# EAGLE design usb lcd  (EAGLE 6.1)
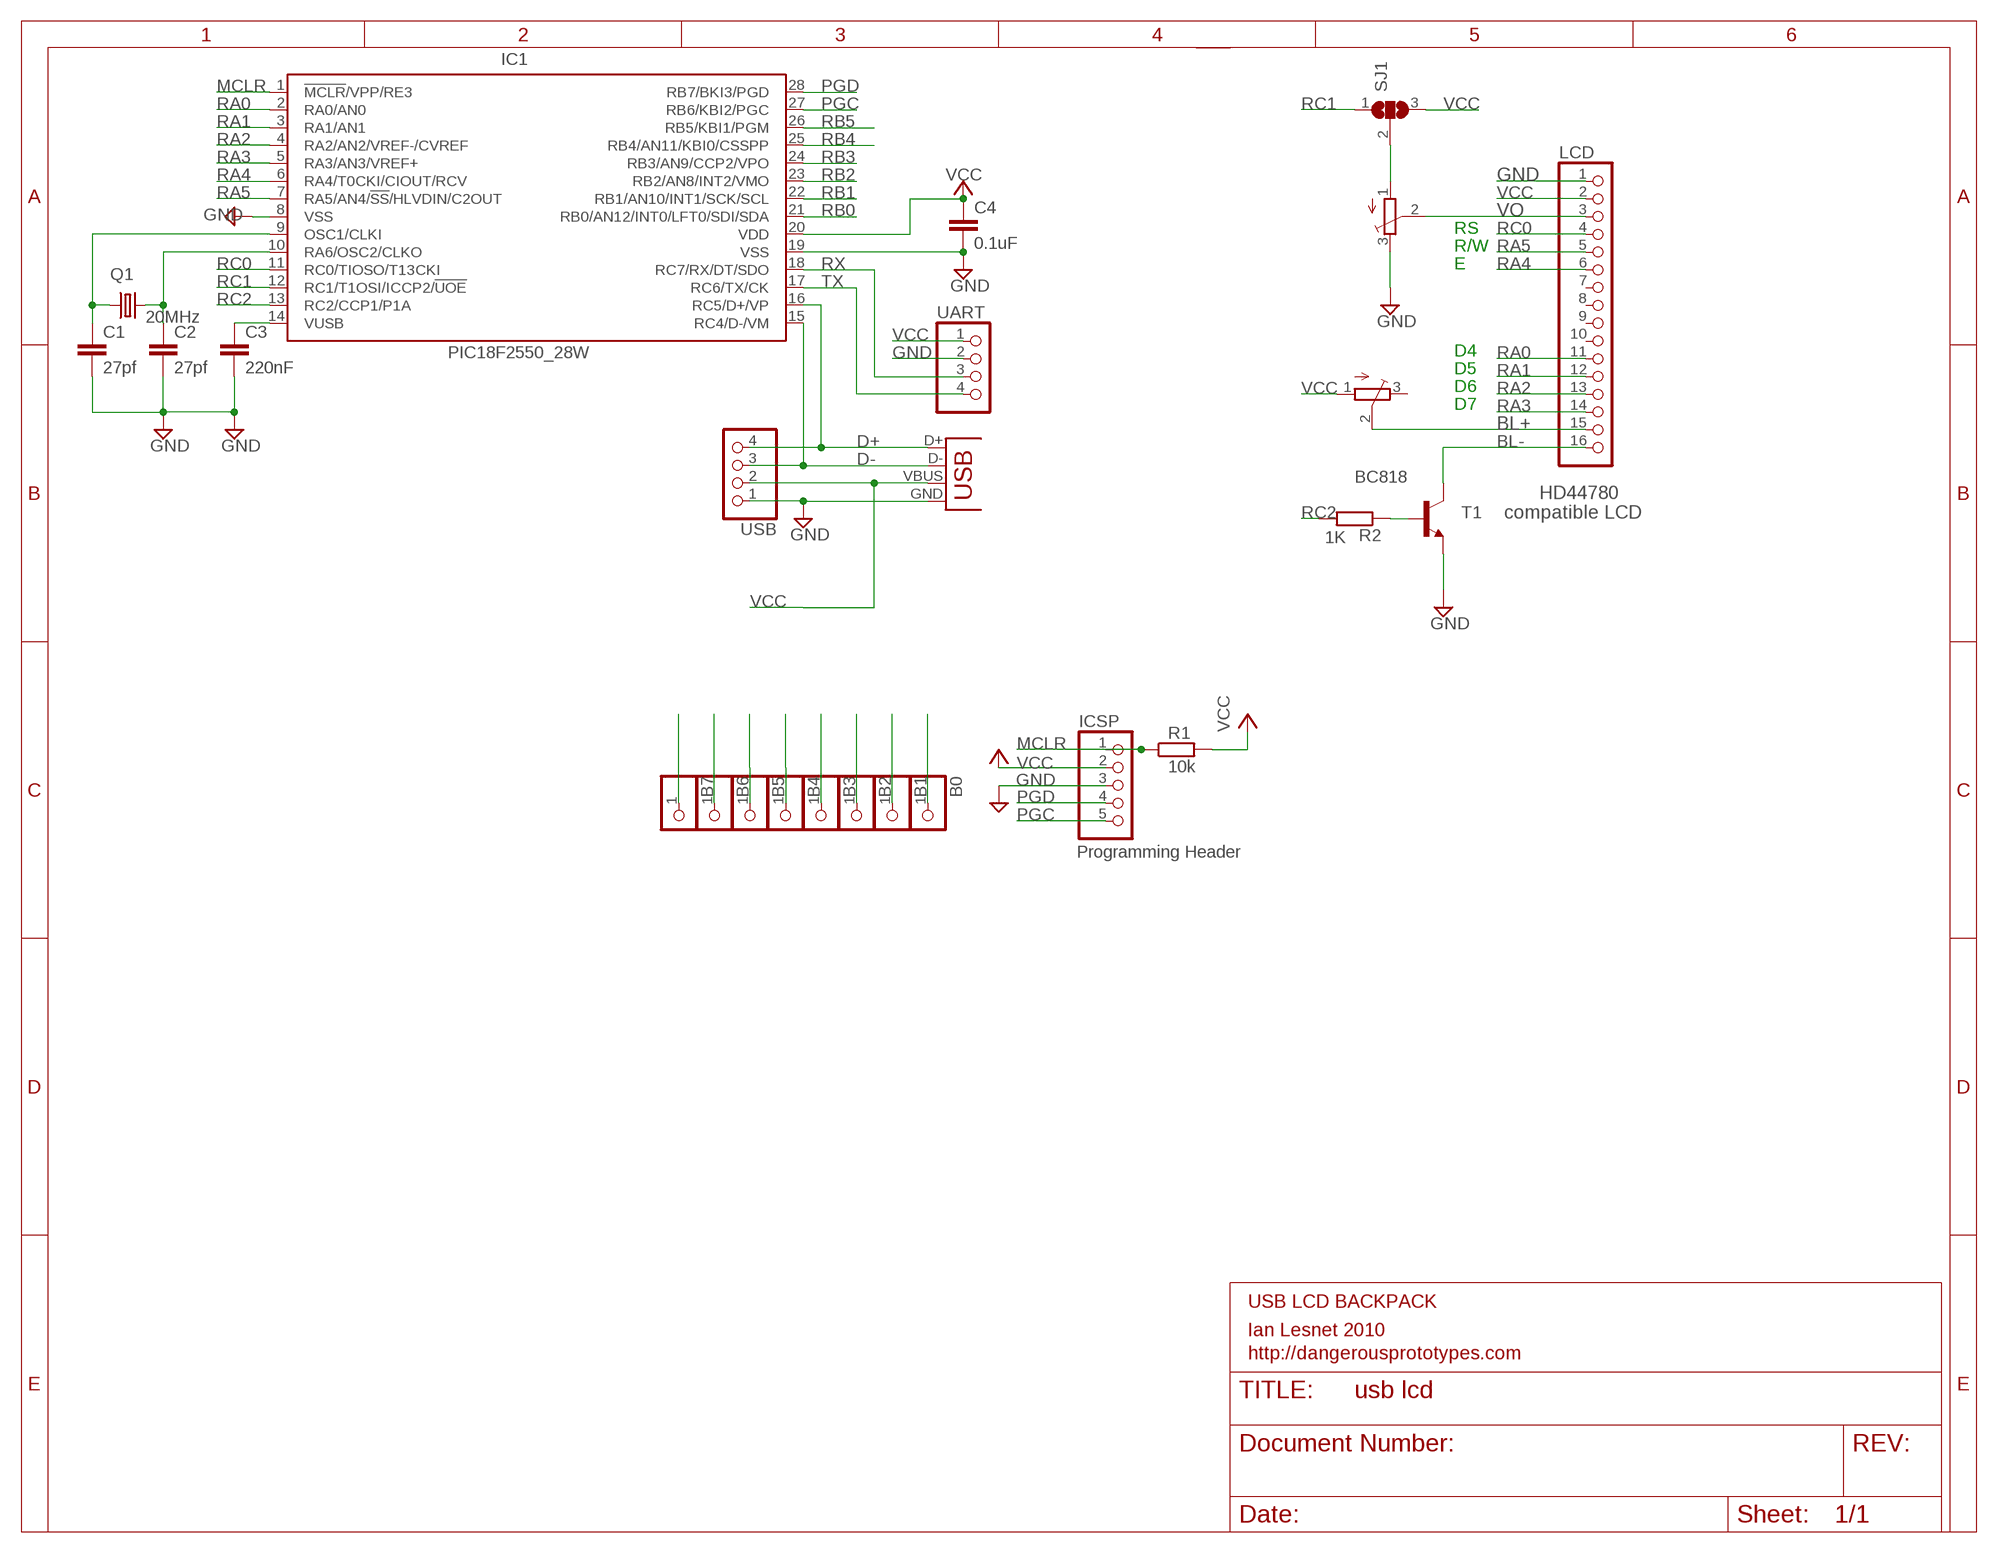
[diagram p0: schematic, sheet 1]

## Parts
B0  PINHD-1X1  [1X01]
B1  PINHD-1X1  [1X01]
B2  PINHD-1X1  [1X01]
B3  PINHD-1X1  [1X01]
B4  PINHD-1X1  [1X01]
B5  PINHD-1X1  [1X01]
B6  PINHD-1X1  [1X01]
B7  PINHD-1X1  [1X01]
C1  27pf  C-EUC0805  [C0805]
C2  27pf  C-EUC0805  [C0805]
C3  220nF  C-EUC0805  [C0805]
C4  0.1uF  C-EUC0805  [C0805]
IC1  PIC18F2550_28W  [SO28W]
ICSP  PINHD-1X5  [1X05]
J1  USBSMD  [USB-MINIB]
LCD  PINHD-1X16  [1X16]
Q1  20MHz  CRYSTALHC49UP  [HC49UP]
R1  10k  R-EU_R0805  [R0805]
R2  1K  R-EU_M0805  [M0805]
SJ1  SJ2W  [SJ_2]
T1  BC818  NPNSOT23BEC  [SOT23-BEC]
U$3  3MM_TRIMPOT  [3MM_TRIMPOT]
U$4  3MM_TRIMPOT  [3MM_TRIMPOT]
UART  PINHD-1X4  [1X04]
USB  PINHD-1X4  [1X04]

## Nets
BASE: R2.1 T1.B
BL+: LCD.15 U$4.2(S)
BL-: LCD.16 T1.C
D+: IC1.16(RC5/D+/VP) J1.D+ USB.4
D-: IC1.15(RC4/D-/VM) J1.D- USB.3
GND: C1.2 C2.2 C3.2 C4.2 IC1.8(VSS) IC1.19(VSS) ICSP.3 J1.GND LCD.1 T1.E U$3.3(E) UART.2 USB.1
MCLR: IC1.1(!MCLR!/VPP/RE3) ICSP.1 R1.1
N$1: SJ1.2 U$3.1(A)
N$4: C2.1 IC1.10(RA6/OSC2/CLKO) Q1.2
N$5: C1.1 IC1.9(OSC1/CLKI) Q1.1
N$6: C3.1 IC1.14(VUSB)
PGC: B6.1 IC1.27(RB6/KBI2/PGC) ICSP.5
PGD: B7.1 IC1.28(RB7/BKI3/PGD) ICSP.4
RA0: IC1.2(RA0/AN0) LCD.11
RA1: IC1.3(RA1/AN1) LCD.12
RA2: IC1.4(RA2/AN2/VREF-/CVREF) LCD.13
RA3: IC1.5(RA3/AN3/VREF+) LCD.14
RA4: IC1.6(RA4/T0CKI/CIOUT/RCV) LCD.6
RA5: IC1.7(RA5/AN4/!SS!/HLVDIN/C2OUT) LCD.5
RB0: B0.1 IC1.21(RB0/AN12/INT0/LFT0/SDI/SDA)
RB1: B1.1 IC1.22(RB1/AN10/INT1/SCK/SCL)
RB2: B2.1 IC1.23(RB2/AN8/INT2/VMO)
RB3: B3.1 IC1.24(RB3/AN9/CCP2/VPO)
RB4: B4.1 IC1.25(RB4/AN11/KBI0/CSSPP)
RB5: B5.1 IC1.26(RB5/KBI1/PGM)
RC0: IC1.11(RC0/TIOSO/T13CKI) LCD.4
RC1: IC1.12(RC1/T1OSI/ICCP2/!UOE) SJ1.1
RC2: IC1.13(RC2/CCP1/P1A) R2.2
RX: IC1.18(RC7/RX/DT/SDO) UART.3
TX: IC1.17(RC6/TX/CK) UART.4
VCC: C4.1 IC1.20(VDD) ICSP.2 J1.VBUS LCD.2 R1.2 SJ1.3 U$4.1(A) UART.1 USB.2
VO: LCD.3 U$3.2(S)
Unconnected: LCD.7 LCD.8 LCD.9 LCD.10 U$4.3(E)

## Notes on the sheet
- RS
- R/W
- E
- D4
- D5
- D6
- D7
- HD44780
- compatible LCD
- Programming Header
- USB LCD BACKPACK
- Ian Lesnet 2010
- http://dangerousprototypes.com

## Library data of the parts
B0 B1-B7 = pinhead:PINHD-1X1: PIN HEADER
C1-C4 = resistor:C-EU: CAPACITOR, European symbol
IC1 = microchip:PIC18F2*_28: USB Microcontrollers with nanoWatt Technology High-Performance, Enhanced Flash, 28/40/44-Pin, Source: http://ww1.microchip.com/downloads/en/devicedoc/39632c.pdf
ICSP = pinhead-2:PINHD-1X5: PIN HEADER
J1 = SparkFun:USB: USB Connectors USB-B-PTH is fully proven SKU : PRT-00139 USB-miniB is fully proven SKU : PRT-00587 USB-A-PCB is untested. USB-A-H is throughly reviewed, but untested. Spark Fun Electronics SKU : PRT-00437 USB-B-SMT is throughly reviewed, but untested. Needs silkscreen touching up. USB-A-S has not been used/tested USB-MB-H has not been used/tested
LCD = pinhead:PINHD-1X16: PIN HEADER
Q1 = crystal:CRYSTAL: CRYSTAL
R1 R2 = rcl:R-EU_: RESISTOR, European symbol
SJ1 = jumper:SJ2W: SMD solder JUMPER
T1 = dp_devices:NPN: Most commonly used is SOT23-BEC
U$3 U$4 = BaseApp:3MM_TRIMPOT: 10k :- http://www.digikey.com/product-detail/en/TC33X-2-103E/TC33X-103ECT-ND/612911
UART USB = pinhead - Copy:PINHD-1X4: PIN HEADER

## Board
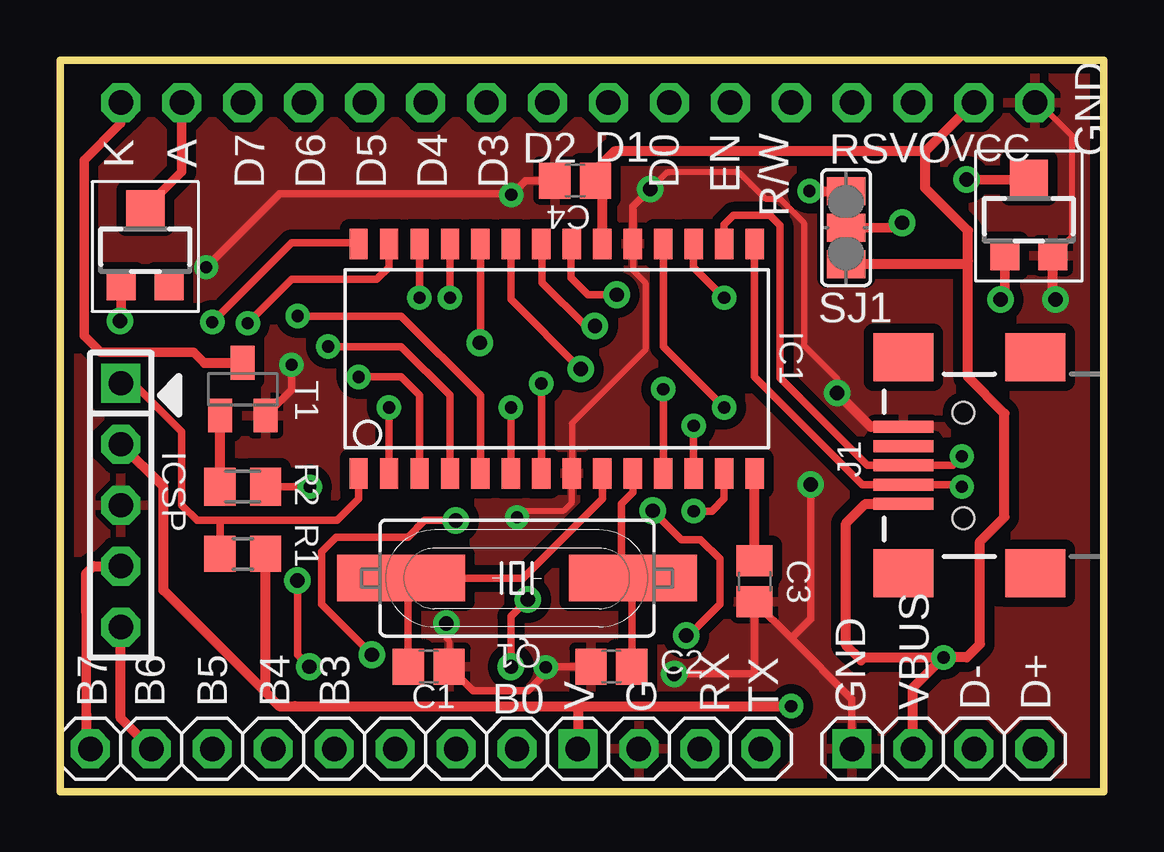
[diagram p1: board, top side]
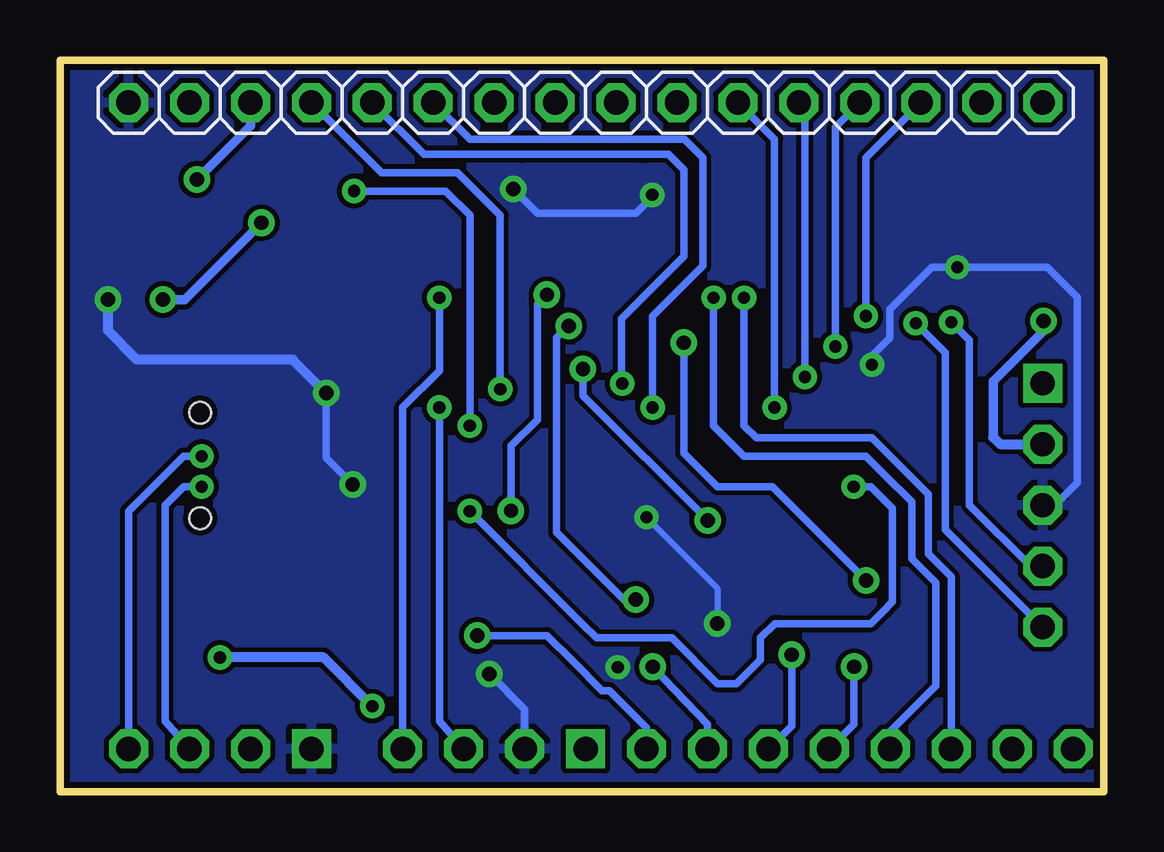
[diagram p2: board, bottom side, seen from below]

Size 43.5 x 30.48 mm. Coordinates in mm from the lower left corner, seen from the top.
Outline: 43.5,30.48 0,30.48 0,0 43.5,0 43.5,30.48
Copper layers (1*16): Top 0.035mm / dielectric 1.5mm / Bottom 0.035mm
Design rules: minimum track width 8mil, minimum drill 20mil, track to track 8mil, track to pad 8mil, pad to pad 8mil, via to via 8mil, smd to smd 8mil, copper to edge 10mil, drill to drill 8mil, minimum pad ring 12mil, minimum via ring 10mil, stop-mask expansion 4mil, vias tented up to drill 25mil, thermal gap 10mil

### Footprints (pad centres in the part's own frame; a part is rotated, then mirrored left to right if it is on the bottom)
1X01 = drill 1.016 octagon: 1 0,0
C0805 = smd 1.3 x 1.5: 1 -0.85,0; 2 0.85,0
SO28W = smd 0.762 x 1.27: 1 -7.62,-4.78; 2 -6.35,-4.78; 3 -5.08,-4.78; 4 -3.81,-4.78; 5 -2.54,-4.78; 6 -1.27,-4.78; 7 0,-4.78; 8 1.27,-4.78; 9 2.54,-4.78; 10 3.81,-4.78; 11 5.08,-4.78; 12 6.35,-4.78; 13 7.62,-4.78; 14 8.89,-4.78; 15 8.89,4.78; 16 7.62,4.78; 17 6.35,4.78; 18 5.08,4.78; 19 3.81,4.78; 20 2.54,4.78; 21 1.27,4.78; 22 0,4.78; 23 -1.27,4.78; 24 -2.54,4.78; 25 -3.81,4.78; 26 -5.08,4.78; 27 -6.35,4.78; 28 -7.62,4.78
1X05 = drill 1.016 square: 1 -5.08,0 | drill 1.016 octagon: 2 -2.54,0; 3 0,0; 4 2.54,0; 5 5.08,0
USB-MINIB = smd 2.5 x 0.5: D+ 2.5,0; D- 2.5,0.8; GND 2.5,-1.6; ID 2.5,-0.8; VBUS 2.5,1.6 | smd 2.5 x 2: GND@1 -3,-4.5; GND@2 -3,4.5; GND@3 2.5,4.5; GND@4 2.5,-4.5 | hole 0.9: 0,2.2; 0,-2.2
1X16 = drill 1.016 octagon: 1 -19.05,0; 2 -16.51,0; 3 -13.97,0; 4 -11.43,0; 5 -8.89,0; 6 -6.35,0; 7 -3.81,0; 8 -1.27,0; 9 1.27,0; 10 3.81,0; 11 6.35,0; 12 8.89,0; 13 11.43,0; 14 13.97,0; 15 16.51,0; 16 19.05,0
HC49UP = smd 5.334 x 1.93: 1 -4.826,0; 2 4.826,0
R0805 = smd 1.3 x 1.5: 1 -0.95,0; 2 0.95,0
M0805 = smd 1.3 x 1.6: 1 -0.95,0; 2 0.95,0
SJ_2 = smd 1.168 x 1.6: 1 -1.524,0; 2 0,0; 3 1.524,0
SOT23-BEC = smd 1 x 1.4: B -0.95,-1.1; C 0,1.1; E 0.95,-1.1
3MM_TRIMPOT = smd 1.2 x 1.2: 1 -1,-1.8; 3 1,-1.8 | smd 1.6 x 1.5: 2 0,1.45
1X04 = drill 1.016 square: 1 -3.81,0 | drill 1.016 octagon: 2 -1.27,0; 3 1.27,0; 4 3.81,0

### Placement (x,y rotation side)
B0  19.05,1.78 0 top
B1  16.51,1.78 0 top
B2  13.97,1.78 0 top
B3  11.43,1.78 0 top
B4  8.89,1.78 0 top
B5  6.35,1.78 0 top
B6  3.81,1.78 0 top
B7  1.27,1.78 0 top
C1  15.37,5.21 0 top
C2  22.99,5.21 180 top
C3  28.96,8.76 270 top
C4  21.48,25.45 180 top
IC1  20.07,18.03 0 top
ICSP  2.54,11.93 270 top
J1  37.66,13.59 180 top
LCD  21.59,28.7 0 bottom
Q1  19.05,8.89 0 top
R1  7.62,9.91 0 top
R2  7.62,12.7 0 top
SJ1  32.77,23.5 270 top
T1  7.62,16.76 0 top
U$3  40.39,24.13 0 top
U$4  3.56,22.86 0 top
UART  25.4,1.78 0 top
USB  36.83,1.78 0 top

### Tracks (layer width: path | path; a pad name or v marks a point on that pad's centre or on a via)
BASE
  Top 0.406: R2.1 T1.B
BL+
  Top 0.4: U$4.2 5.08,25.83 LCD.15
BL-
  Top 0.4: LCD.16 2.54,27.84 1,26.3 1,19.9 1,19 1.7,18.3 5.58,18.3 6.01,17.86
  Top 0.406: 6.01,17.86 T1.C
D+  (via drill 0.51)
  Top 0.305: IC1.16 27.69,23.62 28.07,24 29.59,24 30,23.59 30,19.8 30,17.24 30.73,16.51 33.66,13.59 J1.D+ 37.21,13.59 v37.59,13.97
  Bottom 0.305: v37.59,13.97 38.35,13.97 40.64,11.68 USB.4
D-  (via drill 0.51)
  Top 0.305: IC1.15 28.96,17.27 33.44,12.79 J1.D- 37.5,12.79 v37.59,12.7
  Bottom 0.305: USB.3 39.12,2.92 39.12,11.94 38.35,12.7 v37.59,12.7
GND  (via drill 0.51, 0.6)
  Top 0.254: v16.1,7 16.1,6.4 16.22,6.28 C1.2 | IC1.19 23.88,21.72 24.4,21.2 24.4,18.4 22.2,16.2 21.34,15.34 IC1.8 21.34,12.04 21,11.7 19.32,11.7 v19.05,11.43 | v32.4,16.6 32.4,17.2 31,18.6 31,23.7 30,24.7 29.4,24.7 28.8,25.3 28.3,25.8 25.4,25.8 25.3,25.8 v24.6,25.1 | U$3.3 42.2,23.14 42.2,27.3 40.8,28.7 LCD.1
  Top 0.305: T1.E 9.65,16.75 v9.65,17.78 | C1.2 17.22,4.2 19.5,4.2 20.25,4.95 v20.25,5.18 20.28,5.21 C2.2 | 30.48,6.38 C3.2 28.96,4.9 v25.6,4.9 | 30.48,6.38 33.02,3.85 USB.1 | IC1.19 23.88,23.88 23.88,24.38 v24.6,25.1 | C4.2 19.4,25.45 v18.81,24.86 18.77,24.9 15.9,24.9 9.15,24.9 v6.1,21.84 | 30.48,6.38 31.3,7.2 v31.3,12.8
  Top 0.406: J1.GND 33.81,15.19 v32.4,16.6 | v41.5,20.5 41.39,20.61 U$3.3
  Bottom 0.254: v19.05,11.43 16.1,8.48 v16.1,7 | 18.81,24.79 v18.81,24.86
  Bottom 0.305: v9.65,17.78 9.65,18.15 8.9,18.9 8.9,20.1 8.7,20.3 7.16,21.84 v6.1,21.84 2.34,21.84 1.1,20.6 1.1,12.87 2.04,11.93 ICSP.3 | UART.2 24.13,3.43 v25.6,4.9 | v24.6,25.1 23.6,24.1 19.5,24.1 18.81,24.79 | v31.3,12.8 32.4,13.9 v32.4,16.6
  Bottom 0.406: v32.4,16.6 33.8,18 40.3,18 41.5,19.2 v41.5,20.5
  pour Top (isolate 0.406): -2,32 45,32 45,-2 -2,-2
  pour Bottom: -2,33 45,33 45,-3 -2,-3
MCLR
  Top 0.305: IC1.1 12.45,12.19 11.56,11.3 6.6,11.3 | 6.6,11.3 5.71,11.3 5.08,11.94 5.08,14.99 3.56,16.51 3.06,17.01 ICSP.1 | R1.1 6.67,11.24 6.6,11.3
N$1  (via drill 0.6)
  Top 0.4: SJ1.2 34.9,23.5 v35.1,23.7 | v39.2,20.5 39.39,20.69 U$3.1
  Bottom 0.4: v35.1,23.7 38.3,20.5 v39.2,20.5
N$4
  Top 0.305: C2.1 23.84,8.85 Q1.2 23.4,9.37 23.4,12 23.88,12.48 IC1.10
N$5
  Top 0.305: C1.1 14.52,8.6 Q1.1 19.3,8.89 22.61,12.19 IC1.9
N$6
  Top 0.406: C3.1 IC1.14
PGC  (via drill 0.51)
  Top 0.305: IC1.27 13.72,21.84 13.21,21.34 9.65,21.34 v7.83,19.51
  Top 0.406: B6.1 2.54,3.05 ICSP.5
  Bottom 0.305: v7.83,19.51 6.6,18.29 6.6,11.9 6.6,10.91 ICSP.5
PGD  (via drill 0.51)
  Top 0.305: IC1.28 12.45,22.86 9.65,22.86 v6.35,19.56
  Top 0.4: 1.1,7.45 1.1,3.2 | 1.1,1.95 B7.1
  Top 0.406: 1.1,3.2 1.1,1.95 | 1.1,7.45 1.1,9.1 1.39,9.39 ICSP.4
  Bottom 0.305: v6.35,19.56 5.59,18.8 5.59,11.94 3.04,9.39 ICSP.4
RA0  (via drill 0.51)
  Top 0.305: IC1.2 v13.72,16
  Bottom 0.305: v13.72,16 13.72,27.18 LCD.11
RA1  (via drill 0.51)
  Top 0.305: v12.45,17.27 14.22,17.27 14.99,16.51 IC1.3
  Bottom 0.305: v12.45,17.27 12.45,28.45 LCD.12
RA2  (via drill 0.51)
  Top 0.305: v11.18,18.54 14.22,18.54 16.26,16.51 IC1.4
  Bottom 0.305: LCD.13 11.18,27.69 v11.18,18.54
RA3  (via drill 0.51)
  Top 0.305: v9.91,19.81 14.22,19.81 17.53,16.51 IC1.5
  Bottom 0.305: LCD.14 9.91,26.42 v9.91,19.81
RA4  (via drill 0.51)
  Top 0.305: IC1.6 v18.8,16
  Bottom 0.305: LCD.6 26.42,27.18 23.62,27.18 18.88,27.18 17.48,27.18 16.7,26.4 16.7,24 16.7,21.9 18.8,19.8 v18.8,16
RA5  (via drill 0.51)
  Top 0.305: IC1.7 v20.07,17
  Bottom 0.305: LCD.5 28.32,26.54 24.26,26.54 19.3,26.54 | v20.07,17 20.1,17.03 20.1,19.7 17.5,22.3 17.5,23.8 17.5,25.9 18.14,26.54 19.3,26.54 | 19.14,26.54 19.3,26.54
RB0  (via drill 0.6)
  Top 0.305: IC1.21 21.3,22.78 21.3,21.4 22,20.7 v23.2,20.7 | v24.7,11.7 25.9,10.5 26.7,10.5 27.5,9.7 27.5,7.8 26.2,6.5 v26.1,6.5
  Bottom 0.305: v23.2,20.7 23.6,20.3 23.6,15.5 24.7,14.4 v24.7,11.7 | B0.1 19.05,2.65 20.2,3.8 20.6,4.2 20.9,4.2 22.1,5.4 23.2,6.5 v26.1,6.5
RB1  (via drill 0.6)
  Top 0.305: IC1.22 20.1,22.78 20.1,21.2 21.9,19.4 v22.3,19.4 | v19.5,8 18.8,7.3 v18.8,5.2
  Bottom 0.305: v22.3,19.4 22.8,18.9 22.8,10.8 20,8 v19.5,8 | v18.8,5.2 16.51,2.81 B1.1
RB2  (via drill 0.6)
  Top 0.305: v13,5.7 10.9,7.8 10.9,10 11.5,10.6 14.5,10.6 15.2,11.3 v16.5,11.3 | v21.7,17.6 18.8,20.5 IC1.23
  Bottom 0.305: B2.1 13,2.75 v13,5.7 | v16.5,11.3 21.7,16.5 v21.7,17.6
RB3  (via drill 0.6)
  Top 0.305: v10.4,5.2 9.9,5.7 v9.9,8.8 | v17.5,18.7 17.53,18.73 IC1.24
  Bottom 0.305: B3.1 10.4,2.81 v10.4,5.2 | v9.9,8.8 13.8,12.7 16.1,12.7 17.5,14.1 v17.5,18.7
RB4  (via drill 0.51)
  Top 0.305: v16.26,20.57 IC1.25
  Bottom 0.305: v16.26,20.57 16.26,15.24 14.99,13.97 9.91,13.97 9.14,13.21 8,12.06 8,9.7 7,8.7 7,4.4 8.89,2.51 B4.1
RB5  (via drill 0.51)
  Top 0.305: v14.99,20.57 IC1.26
  Bottom 0.305: v14.99,20.57 14.99,15.24 14.48,14.73 9.65,14.73 8.38,13.46 7.3,12.38 7.3,9.9 6.35,8.95 B5.1
RC0  (via drill 0.51)
  Top 0.305: IC1.11 v25.15,16.76
  Bottom 0.305: v25.15,16.76 25.15,24 26.92,25.78 30.1,25.78 LCD.4
RC1  (via drill 0.51)
  Top 0.305: IC1.12 v26.42,15.24
  Top 0.406: v31.24,25.02 SJ1.1
  Bottom 0.305: v31.24,25.02 27.43,25.02 26.42,24 v26.42,15.24
RC2  (via drill 0.51)
  Top 0.305: IC1.13 27.69,12.19 27.18,11.68 v26.42,11.68 | R2.2 v10.41,12.7
  Bottom 0.305: v26.42,11.68 21.73,7 21.13,6.4 18,6.4 16.1,4.5 15.3,4.5 14.3,5.5 14.3,6.4 13.7,7 13.5,7 9.7,7 9.2,7.5 8.8,7.9 8.8,11.8 9.7,12.7 v10.41,12.7
RX  (via drill 0.51)
  Top 0.305: v27.69,16 25.15,18.54 IC1.18
  Bottom 0.305: v27.69,16 27.69,2.92 UART.3
TX  (via drill 0.51)
  Top 0.305: v27.69,20.57 26.42,21.84 IC1.17
  Bottom 0.305: v27.69,20.57 27.69,17.53 29.21,16 UART.4
VCC  (via drill 0.51, 0.6)
  Top 0.4: v2.5,19.6 2.56,19.66 U$4.1
  Top 0.406: v36.83,5.59 36.96,5.46 | 37.85,22.1 37.85,17.27 39.37,15.75 39.37,11.43 38.35,10.41 38.35,6.14 37.8,5.59 v36.83,5.59 | 37.85,22.1 37.85,23.37 36.07,25.15 36.07,26.67 | SJ1.3 37.72,21.97 37.85,22.1 | 21.59,3.56 9.8,3.56 9.14,3.56 8.55,4.15 | 21.59,3.56 v30.48,3.56 | 21.59,3.56 UART.1 | 36.07,26.67 LCD.2 | 36.07,26.67 23.11,26.67 22.33,25.88 C4.1 22.61,25.45 IC1.20 | ICSP.2 4.32,12.69 4.32,12.19 4.32,8.38 5.33,7.37 8.55,4.15 | R1.2 8.55,9.89 8.55,4.15 | J1.VBUS 33.58,11.99 32.77,11.18 32.77,6.1 33.4,5.46 33.53,5.59 v36.83,5.59 | USB.2 35.56,4.32 v36.83,5.59
  Bottom 0.4: 4.6,14.76 4.6,17.1 2.5,19.2 v2.5,19.6
  Bottom 0.406: v36.83,5.59 32.51,5.59 v30.48,3.56 | 4.6,14.76 4.31,14.47 ICSP.2
VO  (via drill 0.6)
  Top 0.4: v37.8,25.5 40.31,25.5 U$3.2
  Bottom 0.4: 35.56,28.07 35.56,27.74 v37.8,25.5
  Bottom 0.406: 35.56,28.07 LCD.3

### Text on the board
tNames: GND | K | A | D7 | D6 | D5 | D4 | D3 | D2 | D0 | D1 | EN | R/W | RS | VO | VCC | V | G | RX | TX | GND | VBUS | D- | D+
Document: 2011 DangerousPrototypes.com | CC-BY-SA